# Altium schematic sheet Sheet1.SchDoc
size B
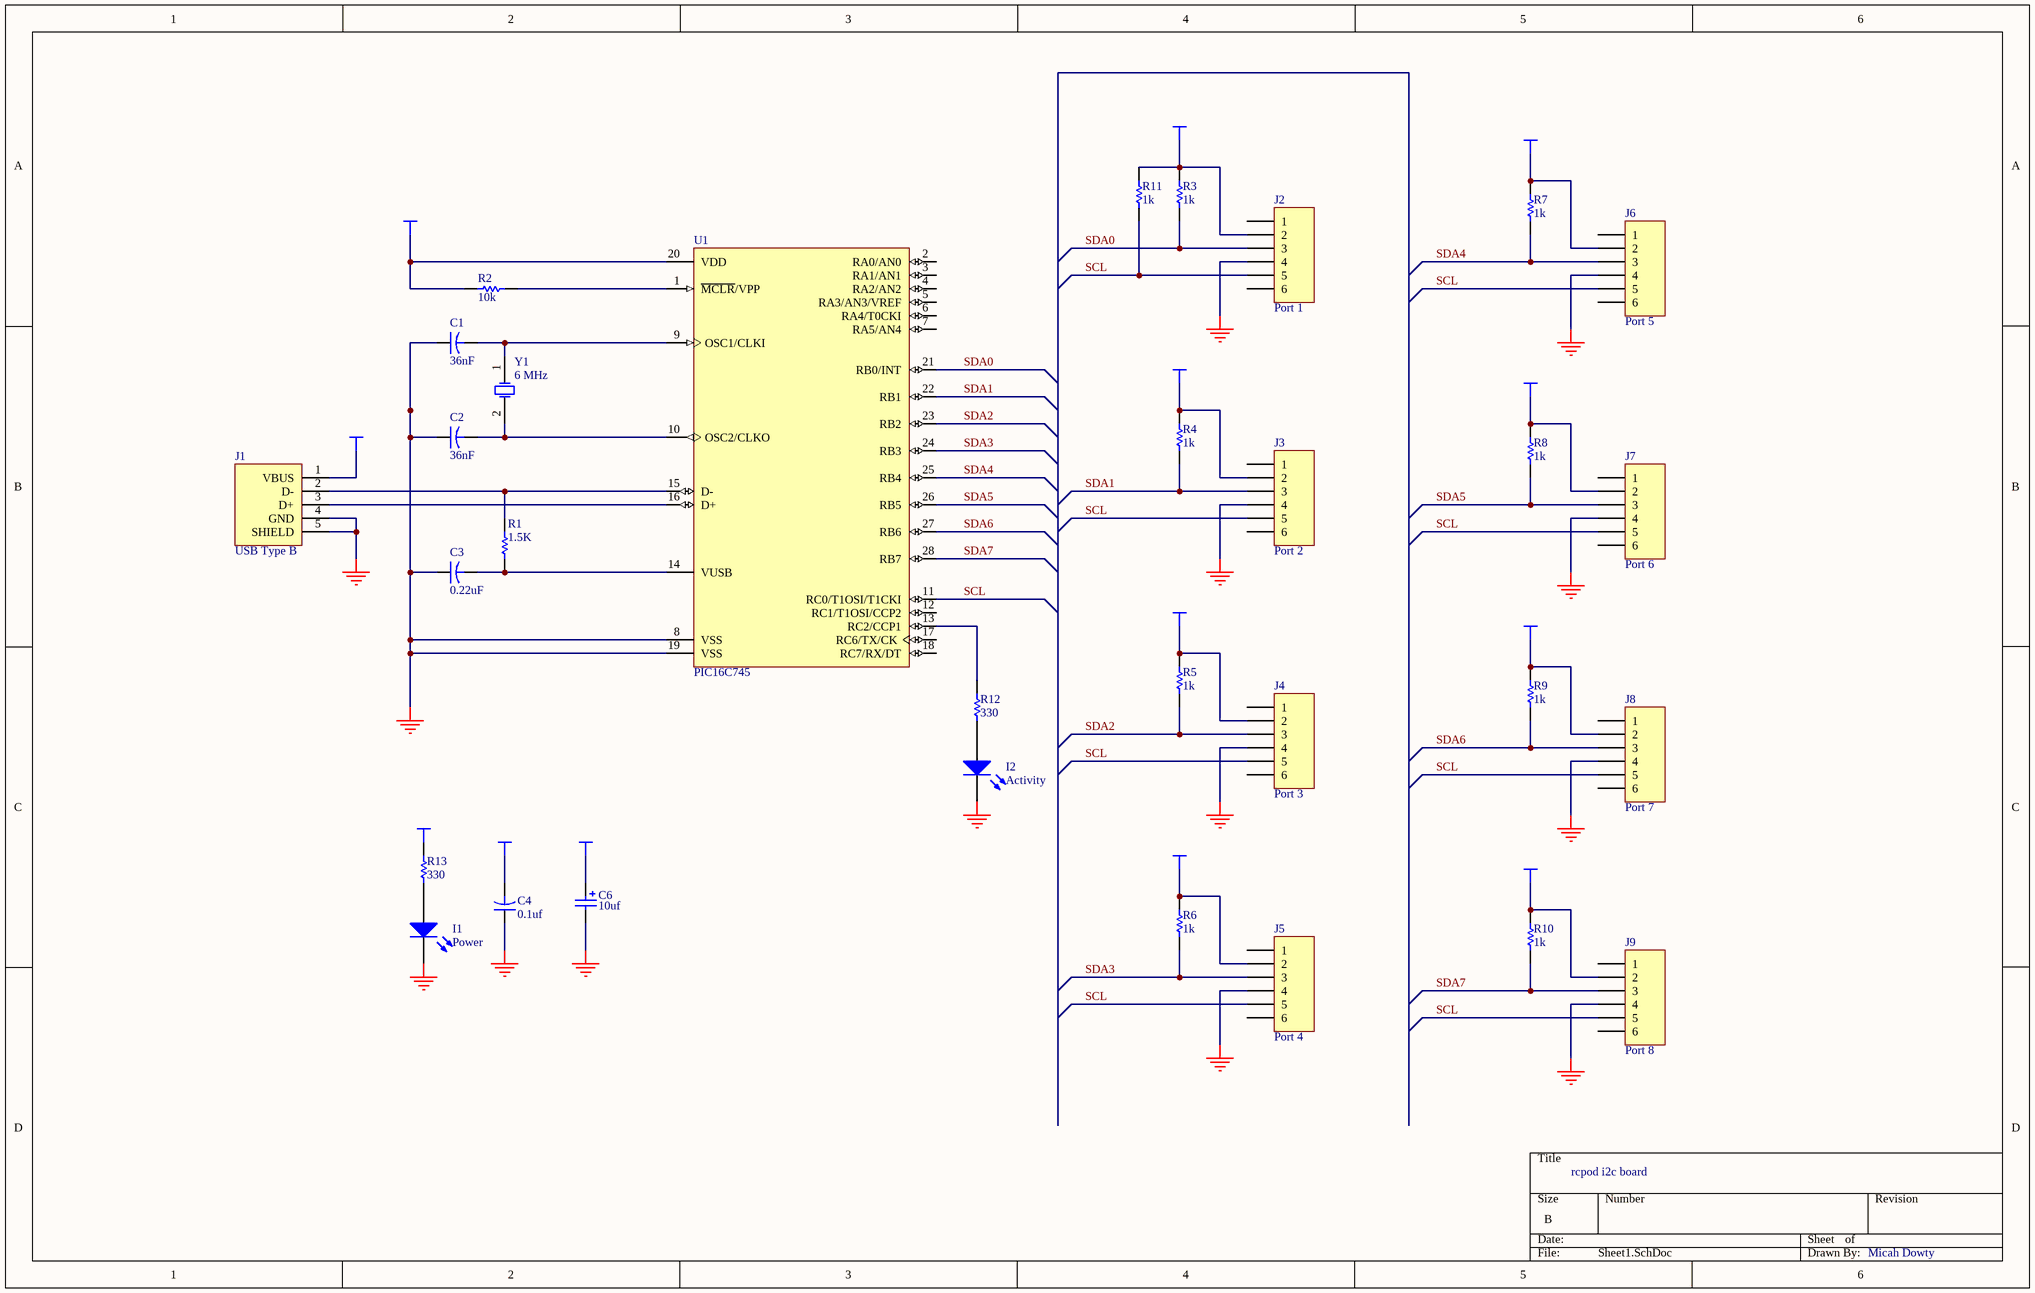
[diagram p0: Sheet1.SchDoc]

## Parts
C1  value 36nF  [CAPR5-4X5]  (hidden comment: Cap2)
C2  value 36nF  [CAPR5-4X5]  (hidden comment: Cap2)
C3  value 0.22uF  [CAPR5-4X5]
C4  value 0.1uf  [CAPR5-4X5]
C6  value 10uf  [CAP-EE-1]  (hidden comment: Cap Pol1)
I1  Power  [LED5MM]
I2  Activity  [LED5MM]
J1  USB  [USB-TYPEB]  (value not drawn)
J2  Port 1  [RJ11]
J3  Port 2  [RJ11]
J4  Port 3  [RJ11]
J5  Port 4  [RJ11]
J6  Port 5  [RJ11]
J7  Port 6  [RJ11]
J8  Port 7  [RJ11]
J9  Port 8  [RJ11]
R1  value 1.5K  [AXIAL-0.3]  (hidden comment: Res1)
R2  value 10k  [AXIAL-0.3]  (hidden comment: Res1)
R3  value 1k  [AXIAL-0.3]  (hidden comment: Res1)
R4  value 1k  [AXIAL-0.3]  (hidden comment: Res1)
R5  value 1k  [AXIAL-0.3]  (hidden comment: Res1)
R6  value 1k  [AXIAL-0.3]  (hidden comment: Res1)
R7  value 1k  [AXIAL-0.3]  (hidden comment: Res1)
R8  value 1k  [AXIAL-0.3]  (hidden comment: Res1)
R9  value 1k  [AXIAL-0.3]  (hidden comment: Res1)
R10  value 1k  [AXIAL-0.3]  (hidden comment: Res1)
R11  value 1k  [AXIAL-0.3]  (hidden comment: Res1)
R12  value 330  [AXIAL-0.3]  (hidden comment: Res1)
R13  value 330  [AXIAL-0.3]  (hidden comment: Res1)
U1  (no value)  [DIP-28]
Y1  6 MHz  [BCY-W2/E4.7]

## Nets
GND: C1.1 C2.1 C3.1 C4.1 C6.2 I1.2(K) I2.2(K) J1.4(GND) J1.5(SHIELD) J2.4 J3.4 J4.4 J5.4 J6.4 J7.4 J8.4 J9.4 U1.8(VSS) U1.19(VSS)
VCC: C4.2 C6.1 J1.1(VBUS) J2.2 J3.2 J4.2 J5.2 J6.2 J7.2 J8.2 J9.2 R2.2 R3.1 R4.1 R5.1 R6.1 R7.1 R8.1 R9.1 R10.1 R11.1 R13.1 U1.20(VDD)
SCL: J2.5 J3.5 J4.5 J5.5 J6.5 J7.5 J8.5 J9.5 R11.2 U1.11(RC0/T1OSI/T1CKI)
SDA0: J2.3 R3.2 U1.21(RB0/INT)
SDA1: J3.3 R4.2 U1.22(RB1)
SDA2: J4.3 R5.2 U1.23(RB2)
SDA3: J5.3 R6.2 U1.24(RB3)
SDA4: J6.3 R7.2 U1.25(RB4)
SDA5: J7.3 R8.2 U1.26(RB5)
SDA6: J8.3 R9.2 U1.27(RB6)
SDA7: J9.3 R10.2 U1.28(RB7)
NetC1_2: C1.2 U1.9(OSC1/CLKI) Y1.1(OSC1)
NetC2_2: C2.2 U1.10(OSC2/CLKO) Y1.2(OSC2)
NetC3_2: C3.2 R1.1 U1.14(VUSB)
NetI1_1: I1.1(A) R13.2
NetI2_1: I2.1(A) R12.2
NetJ1_2: J1.2(D-) R1.2 U1.15(D-)
NetJ1_3: J1.3(D+) U1.16(D+)
NetR2_1: R2.1 U1.1(~{MCLR}/VPP)
NetR12_1: R12.1 U1.13(RC2/CCP1)

Not connected (* = marked no-connect by the designer): J2 1 6; J3 1 6; J4 1 6; J5 1 6; J6 1 6; J7 1 6; J8 1 6; J9 1 6; U1 2(RA0/AN0) 3(RA1/AN1) 4(RA2/AN2) 5(RA3/AN3/VREF) 6(RA4/T0CKI) 7(RA5/AN4) 12(RC1/T1OSI/CCP2) 17(RC6/TX/CK) 18(RC7/RX/DT)

## Notes on the sheet
- rcpod i2c board
- Micah Dowty

## Library data of the parts
C1-C4 = Cap2: Capacitor; Manufacturer: Generic Components; Class I: Passive; Published: 23-Sep-2002; Publisher: Altium Limited; Class II: Capacitor
C6 = Cap Pol1: Polarized Capacitor (Radial); Manufacturer: Generic Components; Class I: Passive; Published: 8-Jun-2000; Revision: July-2002: Re-released for DXP Platform.; Publisher: Altium Limited; Class II: Capacitor
I1 I2 = LED0: Typical INFRARED GaAs LED; Manufacturer: Generic Components; Class I: Optoelectronic; Published: 8-Jun-2000; Revision: July-2002: Re-released for DXP Platform.; Publisher: Altium Limited; Class II: LED
J1 = USB Type B: Header, 4-Pin; Manufacturer: Generic Components; Class I: Connector; Revision: July-2002: Re-released for DXP Platform.; Publisher: Altium Limited
J2-J9 = Header 6: Header, 6-Pin; Manufacturer: Generic Components; Class I: Connector; Revision: July-2002: Re-released for DXP Platform.; Publisher: Altium Limited
R1-R13 = Res1: Resistor; Manufacturer: Generic Components; Class I: Passive; Published: 8-Jun-2000; Revision: July-2002: Re-released for DXP Platform.; Publisher: Altium Limited; Class II: Resistor
U1 = PIC16C745: EPROM-Based 8-Bit CMOS Microcontroller with USB; Manufacturer: Microchip; Revision: Modified for PIC16C745 by Micah Dowty; Package Reference: P40; Class I: Microcontroller; Class II: 8-bit
Y1 = XTAL: Crystal Oscillator; Manufacturer: Generic Components; Published: 8-Jun-2000; Revision: July-2002: Re-released for DXP Platform.; Publisher: Altium Limited; Class I: Oscillator; Class II: Crystal Oscillator